# EAGLE schematic arduino-dust-density-meter (EAGLE 9.4.2)
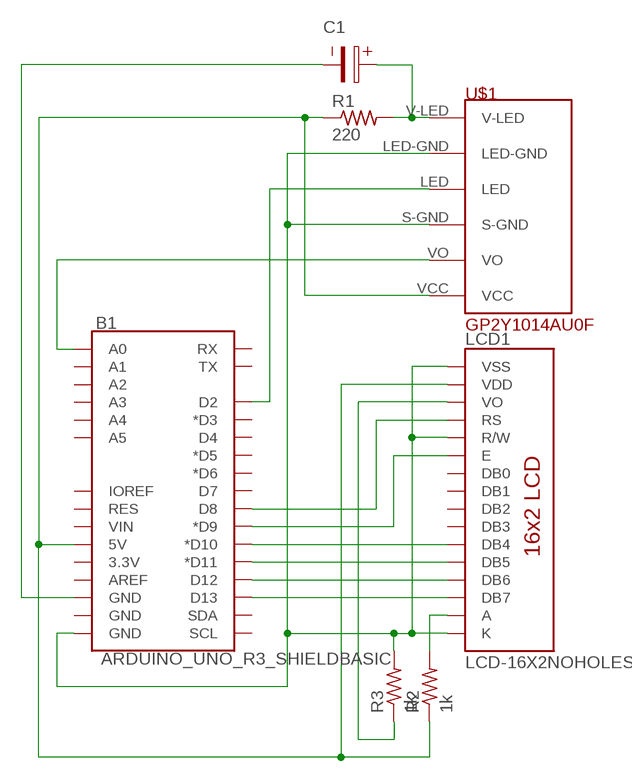
[diagram p0: schematic, sheet 1]

## Parts
B1  ARDUINO_UNO_R3_SHIELDBASIC  [UNO_R3_SHIELD]
C1  WCAP-PTG5_10X12,5_870025575007  [10X5X0.9(DXAXB)]
LCD1  LCD-16X2NOHOLES  [LCD-16X2_NOHOLESNOSILK]
R1  220  R-US_0309/12  [0309/12]
R2  1k  R-US_0309/12  [0309/12]
R3  1k  R-US_0309/12  [0309/12]
U$1  GP2Y1014AU0F  [GP2Y1014AU0F]

## Nets
N$1: C1.1 R1.2 U$1.V-LED
N$2: B1.5V LCD1.2(VDD) R1.1 R2.1 U$1.VCC
N$3: B1.GND@2(GND) C1.2
N$4: B1.GND@0(GND) LCD1.1(VSS) LCD1.5(R/W) LCD1.16(K) R3.2 U$1.LED-GND U$1.S-GND
N$5: B1.D2 U$1.LED
N$6: B1.A0 U$1.VO
N$7: B1.D13 LCD1.14(DB7)
N$8: B1.D12 LCD1.13(DB6)
N$9: B1.D11(*D11) LCD1.12(DB5)
N$10: B1.D10(*D10) LCD1.11(DB4)
N$11: B1.D9(*D9) LCD1.6(E)
N$12: B1.D8 LCD1.4(RS)
N$13: LCD1.15(A) R2.2
N$14: LCD1.3(VO) R3.1
Unconnected: B1.3.3V B1.A1 B1.A2 B1.A3 B1.A4 B1.A5 B1.AREF B1.D3(*D3) B1.D4 B1.D5(*D5) B1.D6(*D6) B1.D7 B1.GND@1(GND) B1.IOREF B1.RES B1.RX B1.SCL B1.SDA B1.TX B1.VIN LCD1.7(DB0) LCD1.8(DB1) LCD1.9(DB2) LCD1.10(DB3)

## Library data of the parts
B1 = SparkFun-Boards:ARDUINO_UNO_R3_SHIELD: Arduino R3 Shield Footprint Shield form compatible with the Arduino Uno R3. SparkFun Products: MG2639 Cellular Shield <https://www.sparkfun.com/products/13120> MIDI Shield <https://www.sparkfun.com/products/12898> R3 Stackable Headers Kit <https://www.sparkfun.com/products/11417>
C1 = Wurth_Elektronik_Passive_Capacitors_rev18b:WCAP-PTG5: WCAP-PTG5 Aluminum Polymer Capacitors Characteristics Aluminum Polymer Capacitor Recommended soldering: Wave Operating temperature: -55°C to +105°C Low ESR at high frequency range High permissible ripple current Load life: 2000h @ +105°C Package name and Variant abbreviation: Package: D X A X B = Diameter of the outline X Pitch of the hole X Diameter of the hole. Variant: D X L X P X Ø = Diameter of the body part X Height of the body part X Pitch of the pin X Diameter of the pin. <http://katalog.we-online.de/media/images/eisos/WCAP-PTG5_pf2.jpg> Details see: http://katalog.we-online.de/en/pbs/WCAP-PTG5/ Created: 2015-02-06 2015 (C) Wurth Elektronik; WE-NUMBER: 870025575007/220uF
LCD1 = SparkFun-Displays:LCD-16X2: Standard text-only 16x2 parallel input LCD Basic 16 character by 2 line display. Typically utilizes the extremely common HD44780 parallel interface chipset SparkFun Products: Basic 16x2 Green <https://www.sparkfun.com/products/255> Basic 8x2 Green <https://www.sparkfun.com/products/11122>; SF_ID: LCD-00255
R1-R3 = BeagleBone_Black_Wireless:R-US_: RESISTOR, American symbol
U$1 = sharp-dust-sensor:GP2Y1014AU0F: GP2Y1014AU0F -Optical Dust Sensor Technical Specifications: VCC: 4.5-5.5V Operating Temperature: -20°C to 65°C Digikey: 1855-1013-ND Mouser: 852-GP2Y1014AU0F